# EAGLE design v1.1 (EAGLE 8.5.1)

## Sheet 1 of 4: power
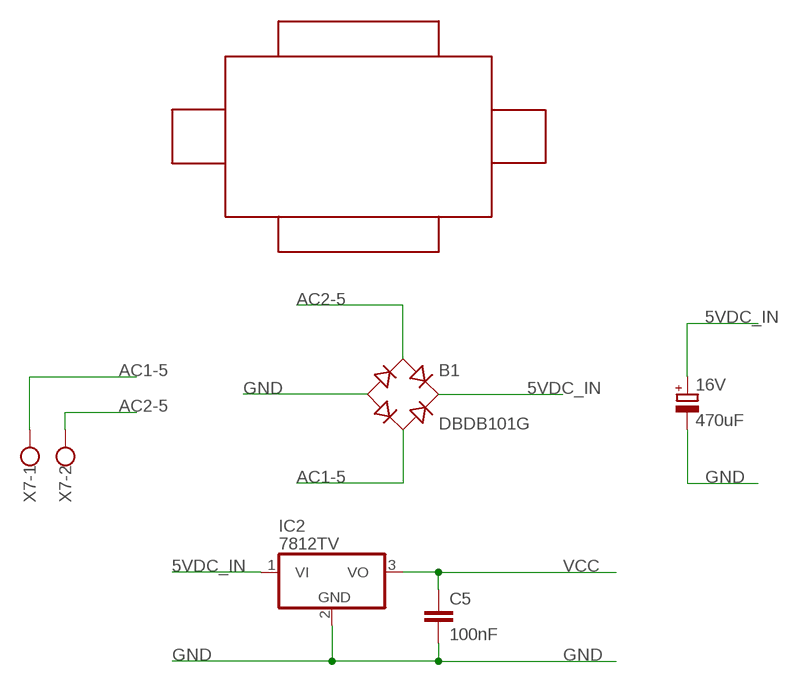
[diagram p0: schematic, sheet 1]

### Parts
16V  470uF  CPOL-EUE3.5-8  [E3,5-8]
B1  DBDB101G  [DB]
C5  100nF  C-EU050-025X075  [C050-025X075]
IC2  7812TV  [TO220V]
U$1  TRANS_12V  [12V]
X7  W237-102  [W237-102]

### Nets
5VDC_IN: 16V.+ B1.+ IC2.1(VI) ; also sheet 4
AC1-5: B1.AC2 X7.1
AC2-5: B1.AC1 X7.2
GND: 16V.- B1.- C5.2 IC2.2(GND) ; also sheet 2,3,4
VCC: C5.1 IC2.3(VO) ; also sheet 2,3

## Sheet 2 of 4
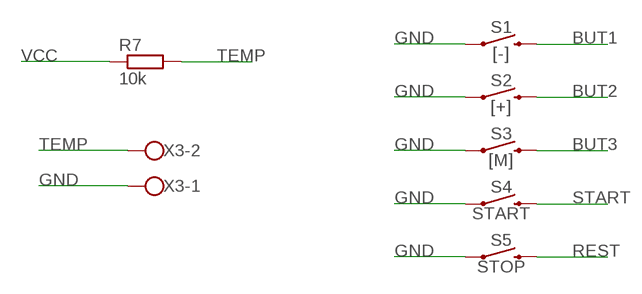
[diagram p1: schematic, sheet 2]

### Parts
R7  10k  R-EU_0207/10  [0207/10]
S1  [-]  MOMENTARY-SWITCH-SPST-PTH-6.0MM  [TACTILE_SWITCH_PTH_6.0MM]
S2  [+]  MOMENTARY-SWITCH-SPST-PTH-6.0MM  [TACTILE_SWITCH_PTH_6.0MM]
S3  [M]  MOMENTARY-SWITCH-SPST-PTH-6.0MM  [TACTILE_SWITCH_PTH_6.0MM]
S4  START  MOMENTARY-SWITCH-SPST-PTH-6.0MM  [TACTILE_SWITCH_PTH_6.0MM]
S5  STOP  MOMENTARY-SWITCH-SPST-PTH-6.0MM  [TACTILE_SWITCH_PTH_6.0MM]
X3  W237-102  [W237-102]

### Nets
BUT1: S1.3 ; also sheet 3
BUT2: S2.3 ; also sheet 3
BUT3: S3.3 ; also sheet 3
GND: S1.1 S2.1 S3.1 S4.1 S5.1 X3.1 ; also sheet 1,3,4
REST: S5.3 ; also sheet 3
START: S4.3 ; also sheet 3
TEMP: R7.2 X3.2 ; also sheet 3
VCC: R7.1 ; also sheet 1,3

## Sheet 3 of 4: process
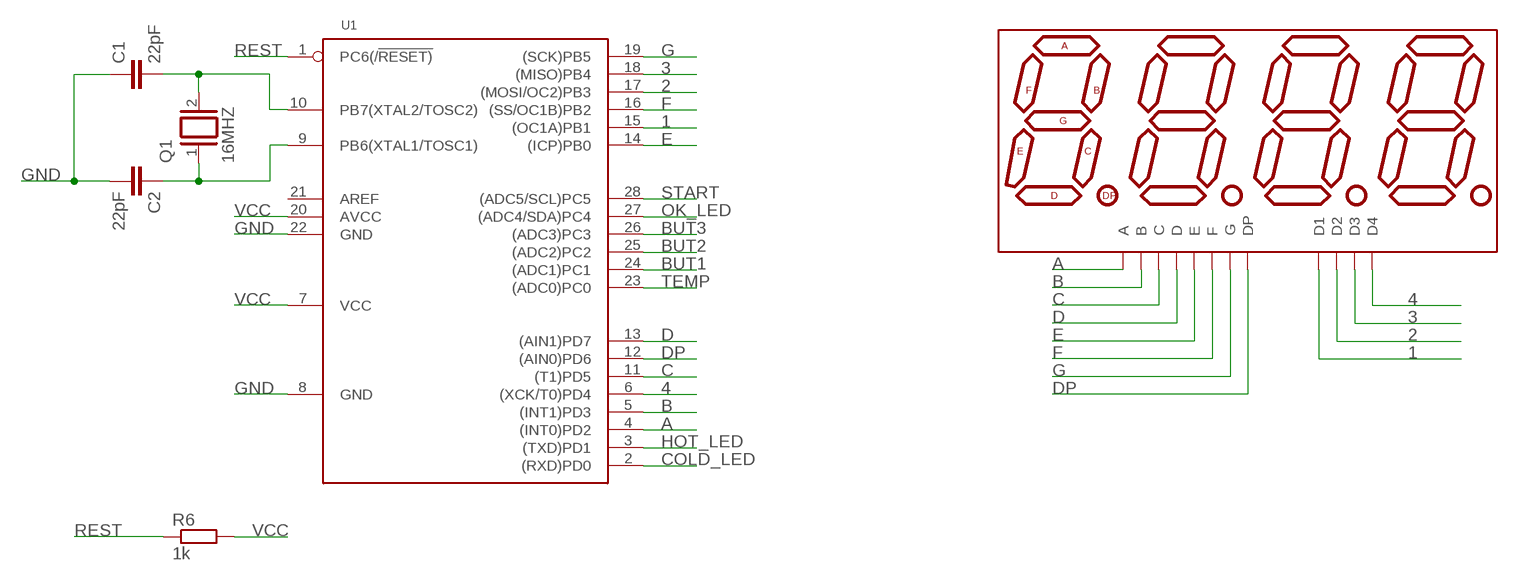
[diagram p2: schematic, sheet 3]

### Parts
C1  22pF  C-EU050-025X075  [C050-025X075]
C2  22pF  C-EU050-025X075  [C050-025X075]
DISP2  ATA8041AB  7-SEGMENT-4DIGIT-20MM-BLUE  [7-SEGMENT-4DIGIT-20MM]
Q1  16MHZ  XTAL/S  [QS]
R6  1k  R-EU_0207/10  [0207/10]
U1  MCU-ATMEGA328P-PU(DIP28)  [DIP28-2.54-34.7X7.62MM]

### Nets
1: DISP2.12(D1) U1.15((OC1A)PB1)
2: DISP2.9(D2) U1.17((MOSI/OC2)PB3)
3: DISP2.8(D3) U1.18((MISO)PB4)
4: DISP2.6(D4) U1.6((XCK/T0)PD4)
A: DISP2.11(A) U1.4((INT0)PD2)
B: DISP2.7(B) U1.5((INT1)PD3)
BUT1: U1.24((ADC1)PC1) ; also sheet 2
BUT2: U1.25((ADC2)PC2) ; also sheet 2
BUT3: U1.26((ADC3)PC3) ; also sheet 2
C: DISP2.4(C) U1.11((T1)PD5)
COLD_LED: U1.2((RXD)PD0) ; also sheet 4
D: DISP2.2(D) U1.13((AIN1)PD7)
DP: DISP2.3(DP) U1.12((AIN0)PD6)
E: DISP2.1(E) U1.14((ICP)PB0)
F: DISP2.10(F) U1.16((SS/OC1B)PB2)
G: DISP2.5(G) U1.19((SCK)PB5)
GND: C1.1 C2.2 U1.8(GND) U1.22(GND) ; also sheet 1,2,4
HOT_LED: U1.3((TXD)PD1) ; also sheet 4
N$1: C1.2 Q1.2 U1.10(PB7(XTAL2/TOSC2))
N$2: C2.1 Q1.1 U1.9(PB6(XTAL1/TOSC1))
OK_LED: U1.27((ADC4/SDA)PC4) ; also sheet 4
REST: R6.1 U1.1(PC6(/!RESET)) ; also sheet 2
START: U1.28((ADC5/SCL)PC5) ; also sheet 2
TEMP: U1.23((ADC0)PC0) ; also sheet 2
VCC: R6.2 U1.7(VCC) U1.20(AVCC) ; also sheet 1,2
Unconnected: U1.21(AREF)

## Sheet 4 of 4: output
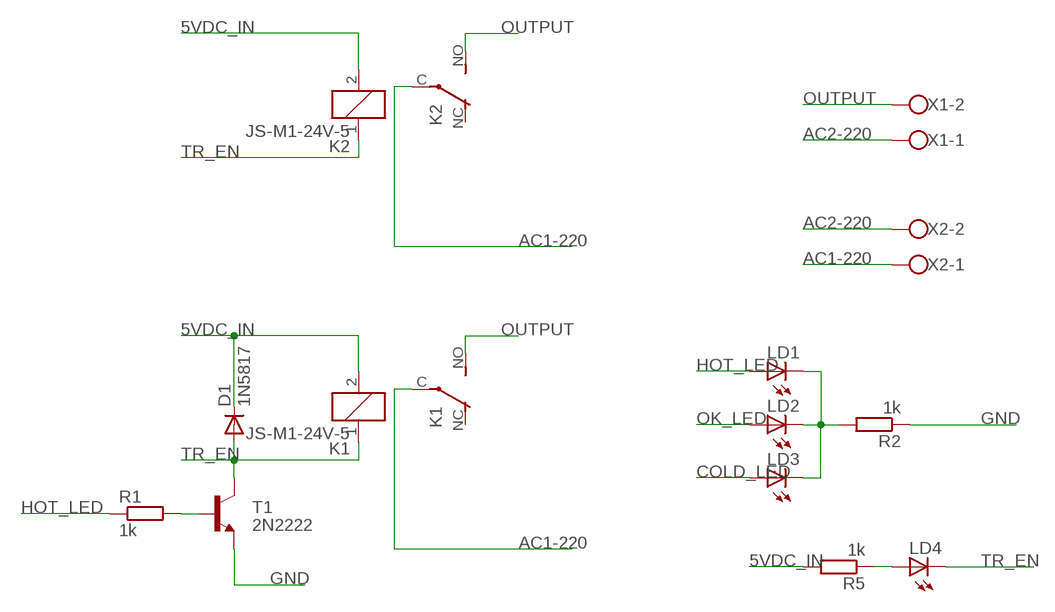
[diagram p3: schematic, sheet 4]

### Parts
D1  1N5817  1N4004  [DO41-10]
K1  JS-M1-24V-5  JS-M1-12V-5  [JS-M]
K2  JS-M1-24V-5  JS-M1-12V-5  [JS-M]
LD1  LED5MM  [LED5MM]
LD2  LED5MM  [LED5MM]
LD3  LED5MM  [LED5MM]
LD4  LED5MM  [LED5MM]
R1  1k  R-EU_0207/10  [0207/10]
R2  1k  R-EU_0207/10  [0207/10]
R5  1k  R-EU_0207/10  [0207/10]
T1  2N2222  [TO92-EBC-OVAL]
X1  W237-102  [W237-102]
X2  W237-102  [W237-102]

### Nets
5VDC_IN: D1.C K1.2 K2.2 R5.2 ; also sheet 1
AC1-220: K1.C(2:P) K2.C(2:P) X2.1
AC2-220: X1.1 X2.2
COLD_LED: LD3.A ; also sheet 3
GND: R2.1 T1.E ; also sheet 1,2,3
HOT_LED: LD1.A R1.1 ; also sheet 3
N$3: LD4.A R5.1
N$4: LD1.K(C) LD2.K(C) LD3.K(C) R2.2
N$7: R1.2 T1.B
OK_LED: LD2.A ; also sheet 3
OUTPUT: K1.NO(2:S) K2.NO(2:S) X1.2
TR_EN: D1.A K1.1 K2.1 LD4.K(C) T1.C
Unconnected: K1.NC(2:O) K2.NC(2:O)

## Library data of the parts
16V = rcl:CPOL-EU: POLARIZED CAPACITOR, European symbol; SPICEPREFIX: C
B1 = rectifier:DB?*G: Single Phase 1.0 AMP Glass Passivated Bridge Rectifier Taiwan Semiconductor Co.,Ltd. - TSC Source: http://www.taiwansemi.com/TSCbig5/ezcatfiles/cust/img/img/db101g.pdf http://www.ts.com.tw/db/pictures/modules/PDT/PDT060207001/DBLS201G.pdf
C1 C2 C5 = rcl:C-EU: CAPACITOR, European symbol; SPICEPREFIX: C
D1 = adafruit:1N4004: DIODE General purpose 1N400x type rectifier (With bigger pads) http://www.ladyada.net/library/pcb/eaglelibrary.html
DISP2 = SparkFun-LED:7-SEGMENT-4DIGIT-20MM: 4 Digit 7 Segment Display This is a part for the 4-Digit 7-segment LEDs from Young Sun. Different from the Digikey LEDs, all 16 pins are used. The LONGPADS Variant is used for a test jig, but you may like it because there is more pad to solder to. If you are concerned about routing space, the standard works just fine though. Datasheets: Red <http://cdn.sparkfun.com/datasheets/Components/LED/1LEDREDCC.pdf> Yellow <http://cdn.sparkfun.com/datasheets/Components/LED/1LEDYELCC.pdf> Green <http://cdn.sparkfun.com/datasheets/Components/LED/1LEDGRNCC.pdf> Blue <http://cdn.sparkfun.com/datasheets/Components/LED/1LEDBLUCC.pdf> White <http://cdn.sparkfun.com/datasheets/Components/LED/1LEDWHTCC.pdf> SparkFun Products Raw Components 7-Segment Display - 20mm (Red) <https://www.sparkfun.com/products/11405> (COM-11405) 7-Segment Display - 20mm (Yellow) <https://www.sparkfun.com/products/11406> (COM-11406) 7-Segment Display - 20mm (Green) <https://www.sparkfun.com/products/11407> (COM-11407) 7-Segment Display - 20mm (Blue) <https://www.sparkfun.com/products/11408> (COM-11408) 7-Segment Display - 20mm (White) <https://www.sparkfun.com/products/11409> (COM-11409) Serial Controlled SparkFun OpenSegment Serial Display - 20mm (Red) <https://www.sparkfun.com/products/11644> (COM-11644) SparkFun OpenSegment Serial Display - 20mm (Yellow) <https://www.sparkfun.com/products/11645> (COM-11645) SparkFun OpenSegment Serial Display - 20mm (Green) <https://www.sparkfun.com/products/11646> (COM-11646) SparkFun OpenSegment Serial Display - 20mm (Blue) <https://www.sparkfun.com/products/11647> (COM-11647) SparkFun OpenSegment Serial Display - 20mm (White) <https://www.sparkfun.com/products/11648> (COM-11648) Other SparkFun OpenSegment Shield <https://www.sparkfun.com/products/13190> (DEV-13190); PROD_ID: COMP-11446
IC2 = linear:78*: Positive VOLTAGE REGULATOR Source: http://cache.national.com/ds/LM/LM78L05.pdf http://www.fairchildsemi.com/ds/LM/LM7805.pdf
K1 K2 = relay:JS-M1*: Automotive Ultra-Miniature Power Relay NAiS Source: http://www.mew-europe.com/.. en_ds_61211_0000.pdf; MF: FARNELL; MPN: JSM1-12V-5; OC_FARNELL: 910351; OC_NEWARK: 14J1764
LD1-LD4 = led:LED: LED OSRAM: - CHIPLED LG R971, LG N971, LY N971, LG Q971, LY Q971, LO R971, LY R971 LH N974, LH R974 LS Q976, LO Q976, LY Q976 LO Q996 - Hyper CHIPLED LW Q18S LB Q993, LB Q99A, LB R99A - SideLED LS A670, LO A670, LY A670, LG A670, LP A670 LB A673, LV A673, LT A673, LW A673 LH A674 LY A675 LS A676, LA A676, LO A676, LY A676, LW A676 LS A679, LY A679, LG A679 - Hyper Micro SIDELED® LS Y876, LA Y876, LO Y876, LY Y876 LT Y87S - SmartLED LW L88C, LW L88S LB L89C, LB L89S, LG L890 LS L89K, LO L89K, LY L89K LS L896, LA L896, LO L896, LY L896 - TOPLED LS T670, LO T670, LY T670, LG T670, LP T670 LSG T670, LSP T670, LSY T670, LOP T670, LYG T670 LG T671, LOG T671, LSG T671 LB T673, LV T673, LT T673, LW T673 LH T674 LS T676, LA T676, LO T676, LY T676, LB T676, LH T676, LSB T676, LW T676 LB T67C, LV T67C, LT T67C, LS T67K, LO T67K, LY T67K, LW E67C LS E67B, LA E67B, LO E67B, LY E67B, LB E67C, LV E67C, LT E67C LW T67C LS T679, LY T679, LG T679 LS T770, LO T770, LY T770, LG T770, LP T770 LB T773, LV T773, LT T773, LW T773 LH T774 LS E675, LA E675, LY E675, LS T675 LS T776, LA T776, LO T776, LY T776, LB T776 LHGB T686 LT T68C, LB T68C - Hyper Mini TOPLED® LB M676 - Mini TOPLED Santana® LG M470 LS M47K, LO M47K, LY M47K Source: http://www.osram.convergy.de/
Q1 = special:XTAL/S: CRYSTAL
R1 R2 R5-R7 = rcl-2:R-EU_: RESISTOR, European symbol
S1-S5 = SparkFun-Switches:MOMENTARY-SWITCH-SPST: Momentary Switch (Pushbutton) - SPST Normally-open (NO) SPST momentary switches (buttons, pushbuttons). Variants PTH-12MM - 12mm square, through-hole Momentary Pushbutton Switch - 12mm Square <https://www.sparkfun.com/products/9190> (COM-09190) PTH-6.0MM, PTH-6.0MM-KIT - 6.0mm square, through-hole Mini Pushbutton Switch <https://www.sparkfun.com/products/97> (COM-00097) KIT package intended for soldering kit's - only one side of pads' copper is exposed. PTH-RIGHT-ANGLE-KIT - Right-angle, through-hole Right Angle Tactile Button <https://www.sparkfun.com/products/10791> - Used on SparkFun BigTime Watch Kit <https://www.sparkfun.com/products/11734> SMD-12MM - 12mm square, surface-mount Tactile Button - SMD (12mm) <https://www.sparkfun.com/products/12993> (COM-12993) Used on SparkFun PicoBoard <https://www.sparkfun.com/products/11888> SMD-4.5MM - 4.5mm Square Trackball Switch Used on SparkFun Blackberry Trackballer Breakout <https://www.sparkfun.com/products/13169> SMD-4.6MMX2.8MM - 4.60mm x 2.80mm, surface mount Used on SparkFun SAMD21 Mini Breakout <https://www.sparkfun.com/products/13664> SMD-5.2MM, SMD-5.2-REDUNDANT - 5.2mm square, surface-mount Mini Pushbutton Switch - SMD <https://www.sparkfun.com/products/8720> (COM-08720) Used on Arduino Pro Mini <https://www.sparkfun.com/products/11114> REDUNDANT package connects both switch circuits together SMD-6.0X3.5MM - 6.0 x 3.5mm, surface mount Momentary Reset Switch SMD <https://www.sparkfun.com/products/8229> (COM-08229) SMD-6.2MM-TALL - 6.2mm square, surface mount Tactile Button - SMD (6mm) <https://www.sparkfun.com/products/12992> Used on SparkFun Digital Sandbox <https://www.sparkfun.com/products/12651> SMD-RIGHT-ANGLE - Right-angle, surface mount Used on SparkFun Block for Intel® Edison - Arduino <https://www.sparkfun.com/products/13036>; PROD_ID: SWCH-08441; SF_SKU: COM-00097
T1 = adafruit:2N2222: NPN TRANSISTOR Big oval pads
U1 = Seeed-IC:MCU-ATMEGA328P-PU(DIP28): 310010051; MPN: ATMEGA328P-PU
U$1 = transformer12v:TRANS_12V
X1-X3 X7 = con-wago-500:W237-102: WAGO SCREW CLAMP

## Board
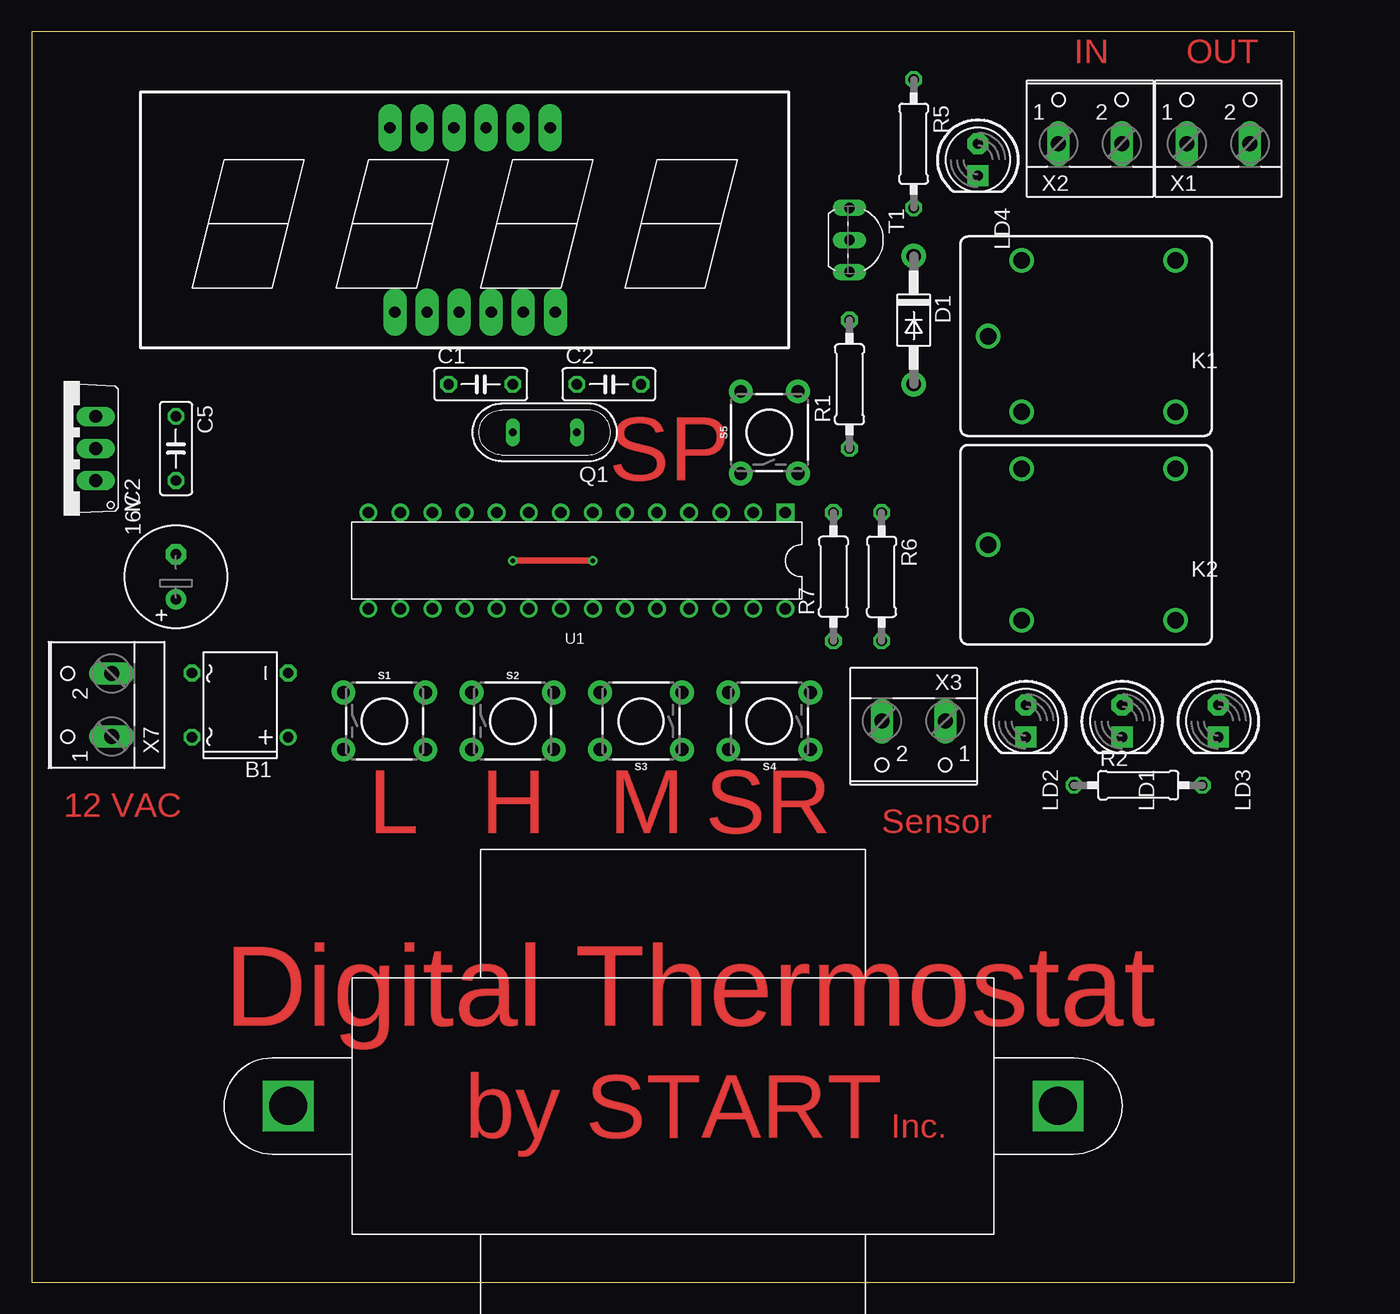
[diagram p4: board, top side]
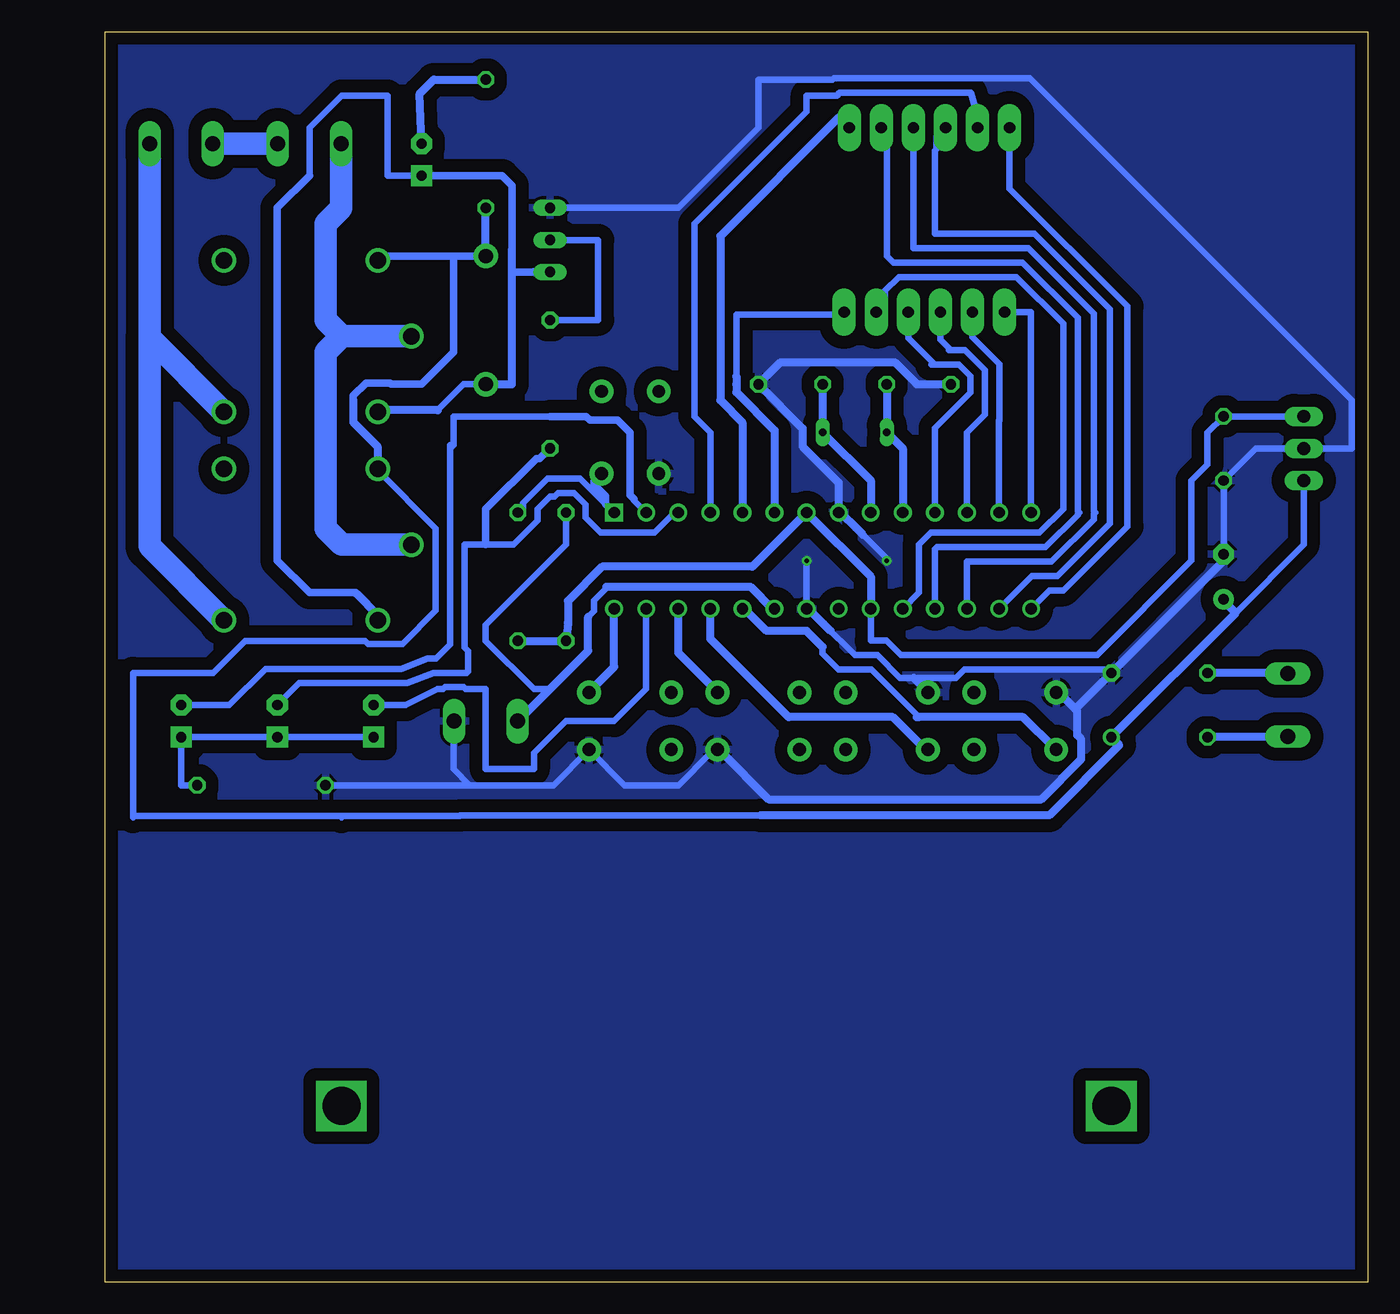
[diagram p5: board, bottom side, seen from below]

Size 100 x 99.05 mm. Coordinates in mm from the lower left corner, seen from the top.
Outline: 0,0 100,0 100,99.05 0,99.05 0,0
Copper layers (1*16): Top 0.035mm / dielectric 1.5mm / Bottom 0.035mm
Design rules "default *": minimum track width 25mil, minimum drill 0.35mm, track to track 40mil, track to pad 40mil, pad to pad 6mil, via to via 6mil, smd to smd 6mil, copper to edge 40mil, drill to drill 6mil, minimum pad ring 10mil, minimum via ring 8mil, stop-mask expansion 4mil, vias tented up to drill 0mil, thermal gap 10mil

### Footprints (pad centres in the part's own frame; a part is rotated, then mirrored left to right if it is on the bottom)
E3,5-8 = drill 0.813 pad 1.6: + -1.778,0 | drill 0.813 pad 1.6 octagon: - 1.778,0
DB = drill 0.813: + -2.54,-3.81 | drill 0.813 octagon: - 2.54,-3.81; AC1 2.54,3.81; AC2 -2.54,3.81
C050-025X075 = drill 0.813 octagon: 1 -2.54,0; 2 2.54,0
DO41-10 = drill 1.118 pad 1.93: A 5.08,0; C -5.08,0
7-SEGMENT-4DIGIT-20MM = drill 0.9 pad 1.88 long: 1 -5.512,-6.985; 2 -2.972,-6.985; 3 -0.432,-6.985; 4 2.108,-6.985; 5 4.648,-6.985; 6 7.188,-6.985; 7 6.782,7.62; 8 4.242,7.62; 9 1.702,7.62; 10 -0.838,7.62; 11 -3.378,7.62; 12 -5.918,7.62
TO220V = drill 1.016 long: 1 -2.54,-2.54; 2 0,-2.54; 3 2.54,-2.54
JS-M = drill 1.3: 1 6.7,6; 2 6.7,-6; C 9.335,0; NC -5.5,-6; NO -5.5,6
LED5MM = drill 0.813 pad 1.676 octagon: A -1.27,0 | drill 0.813 pad 1.676 square: K 1.27,0
QS = drill 0.61 long: 1 -2.54,0; 2 2.54,0
0207/10 = drill 0.813 octagon: 1 -5.08,0; 2 5.08,0
TACTILE_SWITCH_PTH_6.0MM = drill 1.016 pad 1.88: 1 -3.251,2.261; 2 3.251,2.261; 3 -3.251,-2.261; 4 3.251,-2.261
TO92-EBC-OVAL = drill 0.813 long: B 0,-1.27; C 2.54,-1.27; E -2.54,-1.27
DIP28-2.54-34.7X7.62MM = drill 0.9 pad 1.4 square: 1 -16.51,-3.81 | drill 0.9 pad 1.4: 2 -13.97,-3.81; 3 -11.43,-3.81; 4 -8.89,-3.81; 5 -6.35,-3.81; 6 -3.81,-3.81; 7 -1.27,-3.81; 8 1.27,-3.81; 9 3.81,-3.81; 10 6.35,-3.81; 11 8.89,-3.81; 12 11.43,-3.81; 13 13.97,-3.81; 14 16.51,-3.81; 15 16.51,3.81; 16 13.97,3.81; 17 11.43,3.81; 18 8.89,3.81; 19 6.35,3.81; 20 3.81,3.81; 21 1.27,3.81; 22 -1.27,3.81; 23 -3.81,3.81; 24 -6.35,3.81; 25 -8.89,3.81; 26 -11.43,3.81; 27 -13.97,3.81; 28 -16.51,3.81
12V = drill 3 square: P$1 -29.21,0; P$2 31.75,0
W237-102 = drill 1.194 long: 1 -2.5,-1.27; 2 2.5,-1.27

### Placement (x,y rotation side)
16V  11.43,55.88 90 top
B1  16.51,45.72 90 top
C1  35.56,71.12 0 top
C2  45.72,71.12 0 top
C5  11.43,66.04 270 top
D1  69.85,76.2 270 top
DISP2  34.29,83.82 0 top
IC2  2.54,66.04 90 top
K1  85.09,74.93 180 top
K2  85.09,58.42 180 top
LD1  86.36,44.45 270 top
LD2  78.74,44.45 270 top
LD3  93.98,44.45 270 top
LD4  74.93,88.9 270 top
Q1  40.64,67.31 180 top
R1  64.77,71.12 90 top
R2  87.63,39.37 0 top
R5  69.85,90.17 270 top
R6  67.31,55.88 270 top
R7  63.5,55.88 90 top
S1  27.94,44.45 0 top
S2  38.1,44.45 0 top
S3  48.26,44.45 180 top
S4  58.42,44.45 180 top
S5  58.42,67.31 90 top
T1  66.04,82.55 270 top
U1  43.18,57.15 180 top
U$1  49.53,13.97 0 top
X1  93.98,91.44 0 top
X2  83.82,91.44 0 top
X3  69.85,43.18 180 top
X7  5.08,45.72 90 top

### Tracks (layer width: path | path; a pad name or v marks a point on that pad's centre or on a via)
1
  Bottom 0.508: U1.15 25.21,54.8 24.12,54.8 19.05,59.86 19.05,77.3 28.37,86.62 DISP2.12
2
  Bottom 0.508: U1.17 31.75,57.08 25.06,57.08 21.72,60.43 21.72,60.83 21.59,60.96 21.72,61.09 21.72,76.73 26.88,81.89 35.99,81.89 DISP2.9
3
  Bottom 0.508: U1.18 34.29,58.07 34.14,58.22 25.54,58.22 22.99,60.77 22.99,60.83 22.86,60.96 22.99,61.09 22.99,76.39 27.35,80.75 37.57,80.75 38.1,81.28 38.1,91.44 DISP2.8
4
  Bottom 0.508: 50.01,71.12 50.01,76.63 41.68,76.63 DISP2.6
  Bottom 0.635: U1.6 46.99,67.47 50.01,70.48 50.01,71.12 50.01,71.75
5VDC_IN
  Bottom 0.508: IC2.1 5.08,58.42 10.48,53.02 | 48.1,36.99 71.89,36.99 71.92,36.96 81.15,36.96 | 81.15,36.96 81.28,36.83 | 81.15,36.96 97.79,36.96 | 97.79,36.96 97.79,36.83 | 97.79,36.96 97.79,48.26 91.44,48.26 88.9,50.8 79.41,50.8 79.16,50.56 76.44,50.56 73.81,53.19 73.81,59.69 78.39,64.27 K2.2
  Bottom 0.61: D1.C 72.39,81.28 | 72.39,81.28 78.04,81.28 K1.2 | 72.39,81.28 72.39,73.66 74.93,71.12 77.33,71.12 77.44,71.23 79.34,71.23 80.34,70.23 80.34,69.86 80.33,69.85
  Bottom 0.635: D1.C R5.2 | 80.33,69.85 80.33,68.1 78.42,66.2 78.42,64.45 K2.2 | 16V.+ 11.43,53.98 10.48,53.02 B1.+ 19.68,42.55 25.24,36.99 48.1,36.99
A
  Bottom 0.508: U1.4 52.07,67.31 53.34,68.58 53.34,83.82 44.45,92.71 44.45,93.98 42.06,93.98 41.83,94.21 31.42,94.21 30.91,92.43 DISP2.11
AC1-5
  Bottom 0.635: B1.AC2 6.35,43.18 X7.1
AC1-220
  Bottom 1.778: 81.28,74.93 82.55,76.2 82.55,83.82 81.32,85.05 X2.1 | 81.28,74.93 K1.C | 81.28,74.93 82.55,73.66 82.55,59.69 81.28,58.42 K2.C
AC2-5
  Bottom 0.635: B1.AC1 6.35,48.26 X7.2
AC2-220
  Bottom 1.778: X1.1 X2.2
B
  Bottom 0.635: U1.5 49.53,68.1 51.28,69.85 51.28,82.87 41.91,92.23 DISP2.7
BUT1
  Bottom 0.508: 35.56,44.77 39.33,48.54 41.91,48.54 43.18,49.81 43.18,50.32
  Bottom 0.635: U1.24 49.37,53.34 47.62,51.59 44.45,51.59 43.18,50.32 | 35.72,44.77 35.56,44.77 27.3,44.77 24.77,42.23 S1.3
BUT2
  Bottom 0.635: U1.25 52.07,50.96 45.88,44.77 37.62,44.77 34.92,42.07 S2.3
BUT3
  Bottom 0.635: U1.26 54.61,49.85 51.59,46.83 S3.3
C
  Bottom 0.508: U1.11 34.29,67.66 31.47,70.48 31.47,71.76 32.38,72.67 34.29,72.67 | 34.29,72.67 34.57,72.67 | 34.29,72.67 36.4,74.78 DISP2.4
COLD_LED
  Bottom 0.508: LD3.A 90.17,45.72 87.3,48.59 76.56,48.59 74.47,49.42 73.77,49.42 72.67,50.52 72.67,66.04 | U1.2 58.1,61.91 58.1,62.03 | 64.64,68.58 64.77,68.58 72.39,68.58 72.39,66.32 72.67,66.04 | 72.67,66.32 72.67,66.04
  Bottom 0.61: 58.1,62.03 58.42,62.35 58.42,67.31 59.41,68.3 61.62,68.3 61.9,68.58 64.77,68.58
D
  Bottom 0.508: U1.13 29.21,68.23 29.18,68.26 29.18,72.71 31.32,74.84 DISP2.2 31.32,76.2 31.75,76.2
DP
  Bottom 0.508: U1.12 31.75,67.31 30.33,68.73 30.33,72.23 31.91,73.81 33.02,73.81 | 33.17,73.81 33.02,73.81 | DISP2.3 33.86,74.65 33.02,73.81
E
  Bottom 0.508: U1.14 26.67,76.83 DISP2.1
F
  Bottom 0.508: DISP2.10 34.16,90.73 34.16,89.74 34.29,89.62 34.29,83.03 26.4,83.03 20.45,77.08 20.45,60.08 24.59,55.94 26.61,55.94 U1.16
G
  Bottom 0.508: U1.19 35.56,54.61 35.56,58.42 34.61,59.37 26.01,59.37 24.13,61.25 24.13,75.91 27.82,79.6 37.16,79.6 38.23,78.53 38.23,77.55 DISP2.5
GND  (via drill 0.35)
  Top 0.508: v38.1,57.15 v44.45,57.15
  Bottom 0.508: 19.05,49.53 20.04,48.54 31.95,48.54 32.62,47.86 35.96,47.86 37.04,47.86 38.86,49.68 40.63,49.68 43.1,52.15 | T1.E 54.61,85.09 48.26,91.44 48.26,95.25 42.4,95.25 42.3,95.35 26.77,95.35 1.27,69.85 1.27,66.04 IC2.2 8.89,66.04 C5.2 11.43,57.15 | S3.1 51.79,41.91 52.07,41.91 54.61,39.37 58.85,39.37 S4.1 64.49,39.37 71.12,39.37 | 71.12,39.37 72.39,40.64 72.39,44.41 X3.1 | R2.1 71.12,39.37 | 40.56,59.77 38.1,57.31 v38.1,57.15 | v44.45,57.15 U1.22
  Bottom 0.635: U1.22 44.29,53.34 43.1,52.15 42.55,51.59 | 35.96,47.86 34.92,46.83 S2.1 34.61,46.83 | 23.18,45.4 B1.- 19.05,49.53 11.43,57.15 11.27,57.31 11.43,57.47 16V.- 11.43,57.78 | 23.18,45.4 24.61,46.83 S1.1 24.92,46.67 | C1.1 35.72,71.12 37.47,72.87 46.51,72.87 C2.2 44.77,67.63 44.77,66.2 41.91,63.34 U1.8 41.75,60.8 41.59,60.8 40.56,59.77 40.01,59.21 | 23.18,45.4 23.02,45.24 23.02,43.34 22.7,43.02 22.7,41.43 25.88,38.26 47.47,38.26 51.28,42.07 S3.1
  pour Bottom: 0,99.06 100.33,99.06 100.33,0 0,0
HOT_LED
  Bottom 0.508: U1.3 54.9,60.96 56.49,59.37 60.76,59.37 61.95,60.55 61.95,61.6 62.86,62.51 64.14,62.51 64.42,62.23 64.77,62.23 65.76,61.24 65.76,60.32 67.66,58.42 69.85,58.42 71.53,58.42 71.53,50.28 71.25,50 71.25,48.38 71.36,48.27 73.99,48.27 76.09,47.45 84.63,47.45 LD1.A
  Bottom 0.61: R1.1 65.58,65.23 65.84,65.23 69.85,61.22 69.85,58.42
N$1
  Bottom 0.635: C1.2 Q1.2 36.83,66.04 U1.10
N$2
  Bottom 0.635: C2.1 Q1.1 39.37,63.5 U1.9
N$3
  Bottom 0.635: R5.1 73.98,95.25 75.09,94.14 LD4.A
N$4
  Bottom 0.508: LD2.K LD1.K LD3.K 93.98,39.37 R2.2
N$7
  Bottom 0.508: R1.2 60.96,76.2 60.96,82.55 T1.B
OK_LED
  Bottom 0.508: U1.27 57.15,46.99 59.69,44.45 63.5,44.45 66.04,41.91 66.04,40.64 69.85,40.64 69.85,46.99 71.47,46.99 71.61,47.13 73.09,47.13 73.23,46.99 73.66,46.99 76.2,45.72 LD2.A
OUTPUT
  Bottom 1.778: X1.2 96.48,74.82 | 96.48,74.82 K1.NO | K2.NO 96.48,58.31 96.48,74.82
REST
  Bottom 0.508: R6.1 66.9,61.37 66.9,61.71 64.96,63.65 62.38,63.65 U1.1
  Bottom 0.61: S5.3 61.29,63.45 61.29,63.17 60.38,62.25 60.38,61.64 U1.1
START
  Bottom 0.635: U1.28 59.69,48.74 61.59,46.83 S4.3
TEMP
  Bottom 0.508: 61.75,52.7 61.28,53.18 61.28,54 60.33,54.96 60.33,55.09 | 64.77,46.99 66.04,46.99 69.85,50.8 69.85,52.07 63.5,58.42 R7.2
  Bottom 0.635: U1.23 47.15,53.34 48.9,55.09 60.33,55.09 | 61.75,52.7 61.75,50.01 64.77,46.99 67.31,44.45 X3.2
TR_EN
  Bottom 0.508: LD4.K 77.63,87.63 77.63,93.98 81.28,93.98 83.82,91.44 83.82,87.63 | D1.A 71.6,71.12 73.66,69.06
  Bottom 0.61: 67.79,81.28 67.79,86.84 68.58,87.63 LD4.K | 80.09,54.53 80.17,54.61 83.82,54.61 86.36,57.15 86.36,85.09 83.82,87.63 | T1.C 67.79,80.01
  Bottom 0.635: 66.04,80.01 T1.C | 67.79,81.76 67.79,81.28 67.79,80.01 67.79,71.12 D1.A 70.01,71.12 | 80.09,54.53 78.42,52.86 78.42,52.55 K2.1 | 73.66,69.06 78.26,69.06 K1.1
VCC
  Bottom 0.508: IC2.3 C5.1 12.7,67.31 12.7,64.77 13.97,63.5 13.97,57.15 21.44,49.68 36.98,49.68 38.12,50.83 39.37,50.83 U1.20
  Bottom 0.635: R6.2 R7.1 63.34,52.23 63.34,53.98 60.64,56.67 48.74,56.67 U1.7 39.37,55.88 U1.20 | 11.59,68.42 C5.1

### Text on the board
Top: IN | OUT | SP | 12 VAC | L | H | M | SR | Sensor | Digital Thermostat | Inc. | by START